# Altium schematic sheet ASM1117.SchDoc
size A
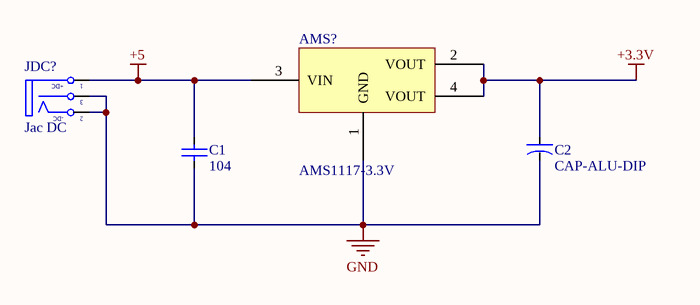
[diagram p0: ASM1117.SchDoc]

## Parts
AMS?  AMS1117-3.3V  [SOT223]
C1  104  [CAP_0402]
C2  CAP-ALU-DIP  [CA-ALU-2.54]
JDC?  Jac DC  [DC-IN]

## Nets
+3.3V: AMS?.2(VOUT) AMS?.4(VOUT) C2.1
+5: AMS?.3(VIN) C1.2 JDC?.1(T)
GND: AMS?.1(GND) C1.1 C2.2 JDC?.2(TN) JDC?.3(S)

## Notes on the sheet
- (in symbol DCIN) +DC; -DC

## Library data of the parts
AMS? = AMS1117 SMD: Dán; Value: AMS1117-3.3V SOT223; Don_Vi: Con; Ma_Hang: MH000596; Ghi_Chu: *; Kieu_Chan: *; Chung_Loai: Dán
C1 = CapSMD: Capacitor; Value: 33p; Published: 8-Jun-2000; LatestRevisionDate: 17-Jul-2002; LatestRevisionNote: Re-released for DXP Platform.; PackageReference: RAD-0.3; Publisher: Altium Limited
C2 = CAP-ALU-DIP: Capacitor (Semiconductor SIM Model); Value: 104; LatestRevisionDate: 17-Jul-2002; LatestRevisionNote: Re-released for DXP Platform.; PackageReference: C1206; Publisher: Altium Limited
JDC? = DCIN: Jac DC input; Value: Jac DC